# Altium schematic sheet ic.SchDoc
size A; SheetNumber: 1; SheetTotal: 4
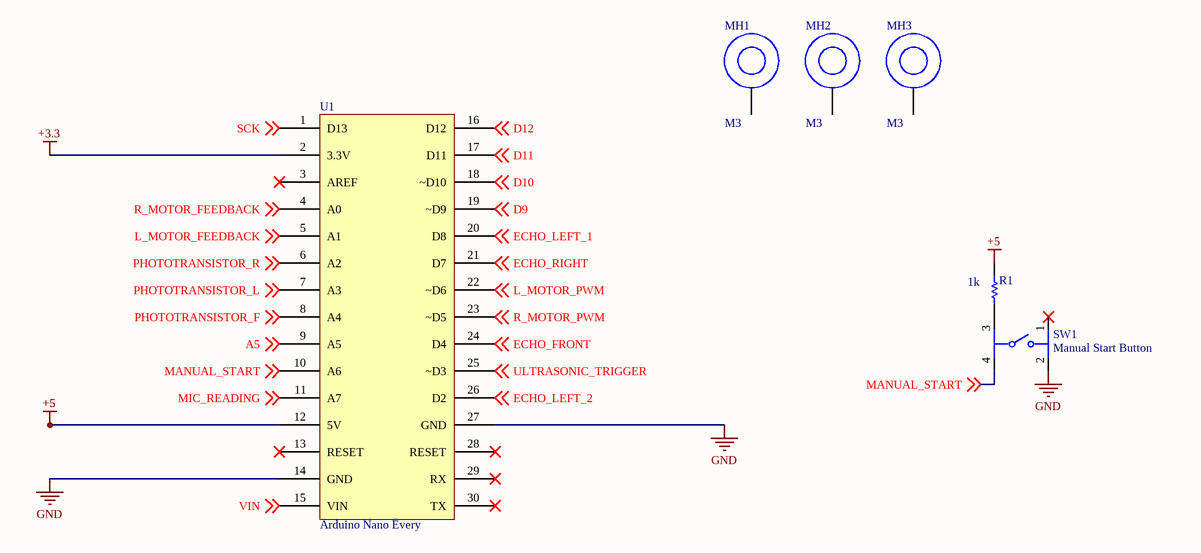
[diagram p0: ic.SchDoc]

## Parts
MH1  M3  [PTH_M3]  (no BOM)
MH2  M3  [PTH_M3]  (no BOM)
MH3  M3  [PTH_M3]  (no BOM)
R1  1k  [RESC2013X50X30NL20T20]
SW1  Manual Start Button  [FP-PTS645SM43SMTR92LFS-MFG]
U1  Arduino Nano Every  [Arduino Nano]

## Nets
+3.3: U1.2(3.3V)
+5: R1.2 U1.12(5V)
GND: SW1.2 U1.14(GND) U1.27(GND)
A5: U1.9(A5) ; off-sheet A5
D9: U1.19(~D9) ; off-sheet D9
D10: U1.18(~D10) ; off-sheet D10
D11: U1.17(D11) ; off-sheet D11
D12: U1.16(D12) ; off-sheet D12
ECHO_FRONT: U1.24(D4) ; off-sheet ECHO_FRONT
ECHO_LEFT_1: U1.20(D8) ; off-sheet ECHO_LEFT_1
ECHO_LEFT_2: U1.26(D2) ; off-sheet ECHO_LEFT_2
ECHO_RIGHT: U1.21(D7) ; off-sheet ECHO_RIGHT
L_MOTOR_FEEDBACK: U1.5(A1) ; off-sheet L_MOTOR_FEEDBACK
L_MOTOR_PWM: U1.22(~D6) ; off-sheet L_MOTOR_PWM
MANUAL_START: SW1.4 U1.10(A6) ; off-sheet MANUAL_START
MIC_READING: U1.11(A7) ; off-sheet MIC_READING
PHOTOTRANSISTOR_F: U1.8(A4) ; off-sheet PHOTOTRANSISTOR_F
PHOTOTRANSISTOR_L: U1.7(A3) ; off-sheet PHOTOTRANSISTOR_L
PHOTOTRANSISTOR_R: U1.6(A2) ; off-sheet PHOTOTRANSISTOR_R
R_MOTOR_FEEDBACK: U1.4(A0) ; off-sheet R_MOTOR_FEEDBACK
R_MOTOR_PWM: U1.23(~D5) ; off-sheet R_MOTOR_PWM
SCK: U1.1(D13) ; off-sheet SCK
ULTRASONIC_TRIGGER: U1.25(~D3) ; off-sheet ULTRASONIC_TRIGGER
VIN: U1.15(VIN) ; off-sheet VIN
NetR1_1: R1.1 SW1.3

Not connected (* = marked no-connect by the designer): MH1 1; MH2 1; MH3 1; SW1 1*; U1 3(AREF)* 13(RESET)* 28(RESET)* 29(RX)* 30(TX)*

## Library data of the parts
MH1-MH3 = PTH: M3 Plated Through Hole; Value: M3
R1 = CMP-1013-00510-2: Part Number: CRCW08051K00FKEA; Manufacturer: Vishay Dale; MPN: CRCW08051K00FKEA
SW1 = CMP-2000-05160-2: SWITCH TACTILE SPST-NO 0.05A 12V; MPN: PTS645SM43SMTR92LFS; Contact Resistance: 100mR; Throw Configuration: SPST; Illumination Type: Non-Illuminated; Mechanical Life: 100000Cycles; Current Rating: 50mA; Switch Function: Off-Mom; Actuator Length: 0.85mm; Actuator Material: Nylon; Actuator Type: Standard; Operating Force: 160gf; Min Operating Temperature: -20°C; REACH SVHC: No SVHC; Termination: Gull Wing; Case/Package: SMD/SMT; Packaging: Tape and Reel; Mount: Surface Mount; Voltage Rating (DC): 12V; Orientation: Straight; Lead Free: Lead Free; Contact Material: Silver; Color: Black; Max Current Rating: 50mA; Contact Plating: Silver; Depth: 9mm; Package Quantity: 1; Max Voltage Rating (DC): 12V; Length: 6mm; Max Operating Temperature: 60°C
U1 = Arduino Mount